# Altium project Ornithopter Camera.PrjPcb
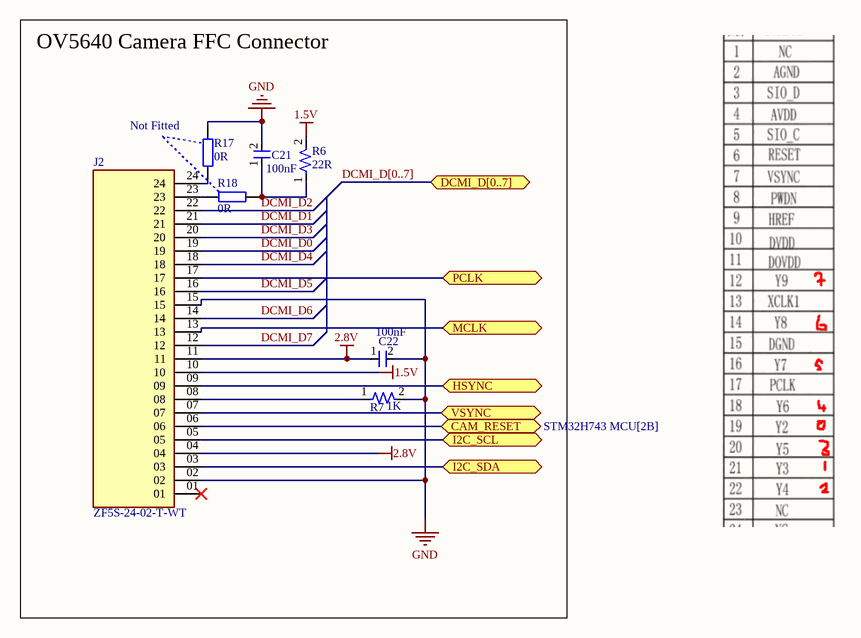
[diagram p0: OV5640 Camera.SchDoc]
5 sheets, 101 parts. Net scope: flat (ports and power ports of the same name join across sheets).
Board file: Camera.PcbDoc
Sheets:
  OV5640 Camera.SchDoc
  External SDRAM.SchDoc
  Microphone-Other Parts.SchDoc
  STM32H743 MCU.SchDoc
  Power Input.SchDoc

## Sheet OV5640 Camera.SchDoc: Ornihopter Kamera Kartı
size A4; CompanyName: Erü EMM; Engineer: Berat Bayram; Address1: https://www.linkedin.com/in/beratbayram-eee/; DocumentNumber: OKK_1; Revision: V1; SheetNumber: 1; SheetTotal: 5

### Parts
C21  C: 100nF  [0603 Cap]  (hidden comment: 0603)
C22  C: 100nF  [0603 Cap]  (hidden comment: 0603)
J2  ZF5S-24-02-T-WT  [SAMTEC_ZF5S-24-02-T-WT]
R6  R: 22R  [0603 Res]  (hidden comment: 0603)
R7  R: 1K  [0603 Res]  (hidden comment: 0603)
R17  0R  [RES_0402]
R18  0R  [RES_0402]

### Ports
CAM_RESET (bidir, see STM32H743 MCU[2B]), DCMI_D[0..7] (bidir, see STM32H743 MCU[8B]), HSYNC (bidir, see STM32H743 MCU[2C]), I2C_SCL (bidir, see STM32H743 MCU[6C]), I2C_SDA (bidir, see STM32H743 MCU[6C]), MCLK (bidir, see STM32H743 MCU[2C]), PCLK (bidir, see STM32H743 MCU[2C]), VSYNC (bidir, see STM32H743 MCU[6C])

### Nets
1.5V: J2.10 R6.2
2.8V: C22.1 J2.04 J2.11
GND: C21.2 C22.2 J2.02 J2.15 R7.2 R17.2
DCMI_D0: J2.19
DCMI_D1: J2.21
DCMI_D2: J2.22
DCMI_D3: J2.20
DCMI_D4: J2.18
DCMI_D5: J2.16
DCMI_D6: J2.14
DCMI_D7: J2.12
NetC21_1: C21.1 R6.1 R18.1
NetJ2_03: J2.03 ; port I2C_SDA
NetJ2_05: J2.05 ; port I2C_SCL
NetJ2_06: J2.06 ; port CAM_RESET
NetJ2_07: J2.07 ; port VSYNC
NetJ2_08: J2.08 R7.1
NetJ2_09: J2.09 ; port HSYNC
NetJ2_13: J2.13 ; port MCLK
NetJ2_17: J2.17 ; port PCLK
NetJ2_23: J2.23 R18.2
NetJ2_24: J2.24 R17.1

Not connected (* = marked no-connect by the designer): J2 01*

### Buses and harness runs
bus DCMI_D[0..7] = port DCMI_D[0..7]

### Notes on the sheet
- OV5640 Camera FFC Connector
- (near R17) Not Fitted
- Title:
- Enigneer:
- Page Contents:
- Company:
- Size:
- Date:
- File:
- Website:
- A4
- Number:
- Time:
- Revision:
- Sheet

### Library data of the parts
C21 C22 = 0603 Cap
R6 R7 = 0603 Res
R17 R18 = RES_0402: Resistor SMD 0402; Manufacturer: *; Manufacturer Part Number: *; Distributor Link: *; LCSC: *
J2 = ZF5S-24-02-T-WT: MP: ZF5S-24-02-T-WT; Value: *; Price: None; Availability: Unavailable; Package: None

## Sheet External SDRAM.SchDoc: Ornihopter Kamera Kartı
size A4; CompanyName: Erü EEM; Engineer: Berat Bayram; Address1: https://www.linkedin.com/in/beratbayram-eee/; DocumentNumber: OKK_1; Revision: V1; SheetNumber: 2; SheetTotal: 5
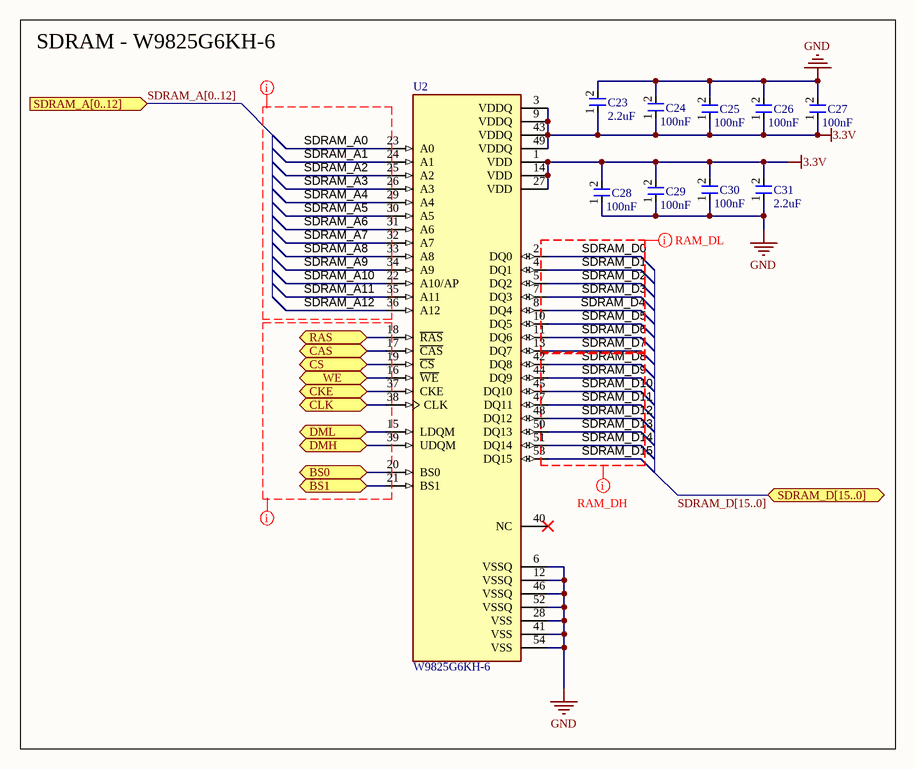
[diagram p1: External SDRAM.SchDoc]

### Parts
C23  C: 2.2uF  [0603 Cap]  (hidden comment: 0603)
C24  C: 100nF  [0603 Cap]  (hidden comment: 0603)
C25  C: 100nF  [0603 Cap]  (hidden comment: 0603)
C26  C: 100nF  [0603 Cap]  (hidden comment: 0603)
C27  C: 100nF  [0603 Cap]  (hidden comment: 0603)
C28  C: 100nF  [0603 Cap]  (hidden comment: 0603)
C29  C: 100nF  [0603 Cap]  (hidden comment: 0603)
C30  C: 100nF  [0603 Cap]  (hidden comment: 0603)
C31  C: 2.2uF  [0603 Cap]  (hidden comment: 0603)
U2  W9825G6KH-6  [SOP80P1176X120-54N]

### Blocks framed on the sheet
SDRAM - W9825G6KH-6: C23-C31 U2

### Ports
BS0 (bidir, see STM32H743 MCU[6B]), BS1 (bidir, see STM32H743 MCU[6B]), CAS (bidir, see STM32H743 MCU[6C]), CKE (bidir, see STM32H743 MCU[4C]), CLK (bidir, see STM32H743 MCU[6C]), CS (bidir, see STM32H743 MCU[4C]), DMH (bidir, see STM32H743 MCU[4B]), DML (bidir, see STM32H743 MCU[4B]), RAS (bidir, see STM32H743 MCU[2C]), SDRAM_A[0..12] (in, see STM32H743 MCU[5A]), SDRAM_D[15..0] (bidir, see STM32H743 MCU[7B]), WE (bidir, see STM32H743 MCU[2C])

### Nets
3.3V: C23.1 C24.1 C25.1 C26.1 C27.1 C28.2 C29.2 C30.2 C31.2 U2.1(VDD) U2.3(VDDQ) U2.9(VDDQ) U2.14(VDD) U2.27(VDD) U2.43(VDDQ) U2.49(VDDQ)
GND: C23.2 C24.2 C25.2 C26.2 C27.2 C28.1 C29.1 C30.1 C31.1 U2.6(VSSQ) U2.12(VSSQ) U2.28(VSS) U2.41(VSS) U2.46(VSSQ) U2.52(VSSQ) U2.54(VSS)
SDRAM_A0: U2.23(A0)
SDRAM_A1: U2.24(A1)
SDRAM_A2: U2.25(A2)
SDRAM_A3: U2.26(A3)
SDRAM_A4: U2.29(A4)
SDRAM_A5: U2.30(A5)
SDRAM_A6: U2.31(A6)
SDRAM_A7: U2.32(A7)
SDRAM_A8: U2.33(A8)
SDRAM_A9: U2.34(A9)
SDRAM_A10: U2.22(A10/AP)
SDRAM_A11: U2.35(A11)
SDRAM_A12: U2.36(A12)
SDRAM_D0: U2.2(DQ0)
SDRAM_D1: U2.4(DQ1)
SDRAM_D2: U2.5(DQ2)
SDRAM_D3: U2.7(DQ3)
SDRAM_D4: U2.8(DQ4)
SDRAM_D5: U2.10(DQ5)
SDRAM_D6: U2.11(DQ6)
SDRAM_D7: U2.13(DQ7)
SDRAM_D8: U2.42(DQ8)
SDRAM_D9: U2.44(DQ9)
SDRAM_D10: U2.45(DQ10)
SDRAM_D11: U2.47(DQ11)
SDRAM_D12: U2.48(DQ12)
SDRAM_D13: U2.50(DQ13)
SDRAM_D14: U2.51(DQ14)
SDRAM_D15: U2.53(DQ15)
NetU1_43: U2.16(~{WE}) ; port WE
NetU1_44: U2.19(~{CS}) ; port CS
NetU1_45: U2.37(CKE) ; port CKE
NetU1_49: U2.18(~{RAS}) ; port RAS
NetU1_89: U2.20(BS0) ; port BS0
NetU1_90: U2.21(BS1) ; port BS1
NetU1_93: U2.38(CLK) ; port CLK
NetU1_132: U2.17(~{CAS}) ; port CAS
NetU1_141: U2.15(LDQM) ; port DML
NetU1_142: U2.39(UDQM) ; port DMH

Not connected (* = marked no-connect by the designer): U2 40(NC)*

### Buses and harness runs
bus SDRAM_A[0..12] = port SDRAM_A[0..12]
bus SDRAM_D[15..0] = port SDRAM_D[15..0]

### Layout directives
net class RAM_DH: SDRAM_D8, SDRAM_D9, SDRAM_D10, SDRAM_D11, SDRAM_D12, SDRAM_D13, SDRAM_D14, SDRAM_D15
net class RAM_DL: SDRAM_D0, SDRAM_D1, SDRAM_D2, SDRAM_D3, SDRAM_D4, SDRAM_D5, SDRAM_D6, SDRAM_D7
net class SD_Add: SDRAM_A0, SDRAM_A1, SDRAM_A2, SDRAM_A3, SDRAM_A4, SDRAM_A5, SDRAM_A6, SDRAM_A7, SDRAM_A8, SDRAM_A9, SDRAM_A10, SDRAM_A11, SDRAM_A12
net class SD_Pins: (no net found under the mark)

### Notes on the sheet
- Title:
- Enigneer:
- Page Contents:
- Company:
- Size:
- Date:
- File:
- Website:
- A4
- Number:
- Time:
- Revision:
- Sheet

### Library data of the parts
C23-C31 = 0603 Cap
U2 = W9825G6KH-6: SDRAM Memory IC 256Mb (16M x 16) Parallel 166MHz 5ns 54-TSOP II; MF: {'manufacturer': u'Winbond Electronics'}; Package: None; MP: W9825G6KH-6; Availability: Unavailable; Price: None

## Sheet Microphone-Other Parts.SchDoc: Ornihopter Kamera Kartı
size A3; CompanyName: Erü EEM; Engineer: Berat Bayram; Address1: https://www.linkedin.com/in/beratbayram-eee/; DocumentNumber: OKK_1; Revision: V1; SheetNumber: 3; SheetTotal: 5
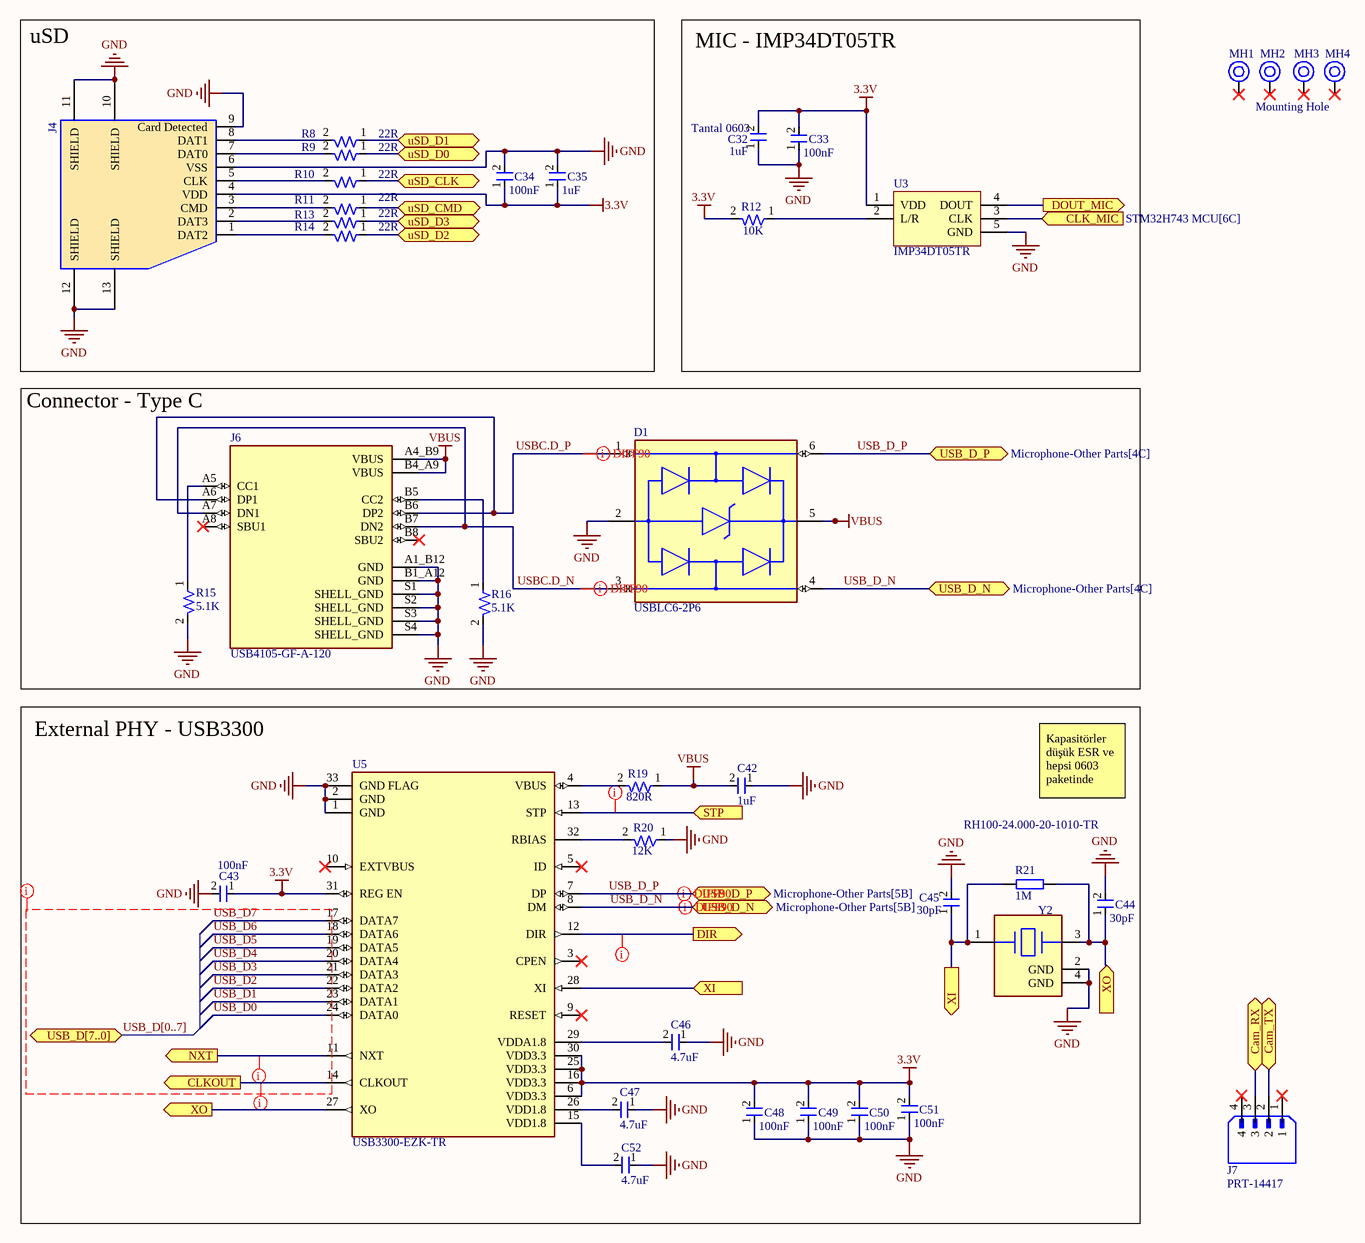
[diagram p2: Microphone-Other Parts.SchDoc]

### Parts
C32  Tantal 0603  C: 1uF  [0603 Cap]
C33  C: 100nF  [0603 Cap]  (hidden comment: 0603)
C34  C: 100nF  [0603 Cap]  (hidden comment: 0603)
C35  C: 1uF  [0603 Cap]  (hidden comment: 0603)
C42  C: 1uF  [0603 Cap]  (hidden comment: 0603)
C43  C: 100nF  [0603 Cap]  (hidden comment: 0603)
C44  C: 30pF  [0603 Cap]  (hidden comment: 0603)
C45  C: 30pF  [0603 Cap]  (hidden comment: 0603)
C46  C: 4.7uF  [0603 Cap]  (hidden comment: 0603)
C47  C: 4.7uF  [0603 Cap]  (hidden comment: 0603)
C48  C: 100nF  [0603 Cap]  (hidden comment: 0603)
C49  C: 100nF  [0603 Cap]  (hidden comment: 0603)
C50  C: 100nF  [0603 Cap]  (hidden comment: 0603)
C51  C: 100nF  [0603 Cap]  (hidden comment: 0603)
C52  C: 4.7uF  [0603 Cap]  (hidden comment: 0603)
D1  USBLC6-2P6  [FP-SOT-666-MFG]
J4  KLS1-TF-003-R  [KLS1-TF-003-R]  (value not drawn)
J6  USB4105-GF-A-120  [GCT_USB4105-GF-A-120]
J7  PRT-14417  [SPARKFUN_PRT-14417]
MH1  Mounting Hole  [MOUNTING]
MH2  Mounting Hole  [MOUNTING]  (value not drawn)
MH3  Mounting Hole  [MOUNTING]  (value not drawn)
MH4  Mounting Hole  [MOUNTING]  (value not drawn)
R8  R: 22R  [0603 Res]  (hidden comment: 0603)
R9  R: 22R  [0603 Res]  (hidden comment: 0603)
R10  R: 22R  [0603 Res]  (hidden comment: 0603)
R11  R: 22R  [0603 Res]  (hidden comment: 0603)
R12  R: 10K  [0603 Res]  (hidden comment: 0603)
R13  R: 22R  [0603 Res]  (hidden comment: 0603)
R14  R: 22R  [0603 Res]  (hidden comment: 0603)
R15  R: 5.1K  [0603 Res]  (hidden comment: 0603)
R16  R: 5.1K  [0603 Res]  (hidden comment: 0603)
R19  R: 820R  [0603 Res]  (hidden comment: 0603)
R20  R: 12K  [0603 Res]  (hidden comment: 0603)
R21  1M  [RES_0603]
U3  IMP34DT05TR  [HCLGA-4_53_137_15X37_SMD]
U5  USB3300-EZK-TR  [FP-32QFN-3304-5X5B-MFG]
Y2  RH100-24.000-20-1010-TR  [FP-ABM8AIG-MFG]

### Blocks framed on the sheet
uSD: C34 C35 J4 R8-R11 R13 R14
MIC - IMP34DT05TR: C32 C33 R12 U3
Connector - Type C: D1 J6 R15 R16
External PHY - USB3300: C42-C52 R19-R21 U5 Y2

### Ports
Cam_RX (bidir, see STM32H743 MCU[2C]), Cam_TX (bidir, see STM32H743 MCU[2C]), CLK_MIC (in, see STM32H743 MCU[6C]), CLKOUT (out, see STM32H743 MCU[2C]), DIR (out, see STM32H743 MCU[4C]), DOUT_MIC (out, see STM32H743 MCU[6C]), NXT (out, see STM32H743 MCU[4C]), STP (in, see STM32H743 MCU[4C]), USB_D[7..0] (bidir, see STM32H743 MCU[7C]), USB_D_N (bidir, see Microphone-Other Parts[4C]), USB_D_N (bidir, see Microphone-Other Parts[5B]), USB_D_P (bidir, see Microphone-Other Parts[4C]), USB_D_P (bidir, see Microphone-Other Parts[5B]), uSD_CLK (bidir, see STM32H743 MCU[4C]), uSD_CMD (bidir, see STM32H743 MCU[4B]), uSD_D0 (bidir, see STM32H743 MCU[4C]), uSD_D1 (bidir, see STM32H743 MCU[4C]), uSD_D2 (bidir, see STM32H743 MCU[4C]), uSD_D3 (bidir, see STM32H743 MCU[4C]), XI (in, see Microphone-Other Parts[5C]), XI (out, see Microphone-Other Parts[4C]), XO (in, see Microphone-Other Parts[2D]), XO (out, see Microphone-Other Parts[6C])

### Nets
3.3V: C32.2 C33.2 C34.1 C35.1 C43.1 C48.2 C49.2 C50.2 C51.2 J4.4(VDD) R12.2 U3.1(VDD) U5.6(VDD3.3) U5.16(VDD3.3) U5.25(VDD3.3) U5.30(VDD3.3) U5.31(REG_EN)
GND: C32.1 C33.1 C34.2 C35.2 C42.1 C43.2 C44.2 C45.2 C46.1 C47.1 C48.1 C49.1 C50.1 C51.1 C52.1 D1.2(GND) J4.6(VSS) J4.9(Card_Detected) J4.10(SHIELD) J4.11(SHIELD) J4.12(SHIELD) J4.13(SHIELD) J6.A1_B12(GND) J6.B1_A12(GND) J6.S1(SHELL_GND) J6.S2(SHELL_GND) J6.S3(SHELL_GND) J6.S4(SHELL_GND) R15.2 R16.2 R20.1 U3.5(GND) U5.1(GND) U5.2(GND) U5.33(GND_FLAG) Y2.2(GND) Y2.4(GND)
VBUS: C42.2 D1.5(VBUS) J6.A4_B9(VBUS) J6.B4_A9(VBUS) R19.1
USB_D0: U5.24(DATA0)
USB_D1: U5.23(DATA1)
USB_D2: U5.22(DATA2)
USB_D3: U5.21(DATA3)
USB_D4: U5.20(DATA4)
USB_D5: U5.19(DATA5)
USB_D6: U5.18(DATA6)
USB_D7: U5.17(DATA7)
USB_D_N: D1.4(I/O2) U5.8(DM) ; port USB_D_N
USB_D_P: D1.6(I/O1) U5.7(DP) ; port USB_D_P
USBC.D_N: D1.3(I/O2) J6.A7(DN1) J6.B7(DN2)
USBC.D_P: D1.1(I/O1) J6.A6(DP1) J6.B6(DP2)
NetC44_1: C44.1 R21.2 U5.27(XO) Y2.3 ; port XO
NetC45_1: C45.1 R21.1 U5.28(XI) Y2.1 ; port XI
NetC46_2: C46.2 U5.29(VDDA1.8)
NetC47_2: C47.2 U5.26(VDD1.8)
NetC52_2: C52.2 U5.15(VDD1.8)
NetJ4_1: J4.1(DAT2) R14.2
NetJ4_2: J4.2(DAT3) R13.2
NetJ4_3: J4.3(CMD) R11.2
NetJ4_5: J4.5(CLK) R10.2
NetJ4_7: J4.7(DAT0) R9.2
NetJ4_8: J4.8(DAT1) R8.2
NetJ6_A5: J6.A5(CC1) R15.1
NetJ6_B5: J6.B5(CC2) R16.1
NetJ7_2: J7.2 ; port Cam_TX
NetJ7_3: J7.3 ; port Cam_RX
NetR8_1: R8.1 ; port uSD_D1
NetR9_1: R9.1 ; port uSD_D0
NetR10_1: R10.1 ; port uSD_CLK
NetR11_1: R11.1 ; port uSD_CMD
NetR12_1: R12.1 U3.2(L/R)
NetR13_1: R13.1 ; port uSD_D3
NetR14_1: R14.1 ; port uSD_D2
NetR19_2: R19.2 U5.4(VBUS)
NetR20_2: R20.2 U5.32(RBIAS)
NetU1_26: U5.13(STP) ; port STP
NetU1_28: U5.12(DIR) ; port DIR
NetU1_29: U5.11(NXT) ; port NXT
NetU1_41: U5.14(CLKOUT) ; port CLKOUT
NetU1_133: U3.3(CLK) ; port CLK_MIC
NetU1_134: U3.4(DOUT) ; port DOUT_MIC

Not connected (* = marked no-connect by the designer): J6 A8(SBU1)* B8(SBU2)*; J7 1* 4*; MH1 1*; MH2 1*; MH3 1*; MH4 1*; U5 3(CPEN)* 5(ID)* 9(RESET)* 10(EXTVBUS)*

### Buses and harness runs
bus USB_D[0..7] = port USB_D[7..0]

### Layout directives
differential pair; differential pair class DIFF90: USB_D_N, USB_D_P, USBC.D_N, USBC.D_P
net class USB3300: NetU1_26, NetU1_28, NetU1_29, NetU1_41, USB_D0, USB_D1, USB_D2, USB_D3, USB_D4, USB_D5, USB_D6, USB_D7, USB_D[0..7]

### Notes on the sheet
- Kapasitörler düşük ESR ve hepsi 0603 paketinde
- Title:
- Enigneer:
- Page Contents:
- Company:
- Size:
- Date:
- File:
- Website:
- A3
- Number:
- Time:
- Revision:
- Sheet

### Library data of the parts
C32-C35 C42-C52 = 0603 Cap
D1 = CMP-12225-000058-1: TVS DIODE 5.25V 17V SOT666; Min Breakdown Voltage: 6V; Power Line Protection: Yes; Element Configuration: Dual; Test Current: 1mA; Working Voltage: 5V; Number of Channels: 2; Max Reverse Leakage Current: 150nA; Direction: Unidirectional; Peak Pulse Current: 5A; Number of Elements: 1; Capacitance: 3.5pF; Max Breakdown Voltage: 6V; Height: 0.6mm; Depth: 1.3mm; Contact Plating: Tin; Reverse Breakdown Voltage: 6V; REACH SVHC: No SVHC; Operating Supply Voltage: 5V; Width: 1.3mm; Max Operating Temperature: 125°C; Reverse Standoff Voltage: 5V; ESD Protection: Yes; Package Quantity: 1; Termination: SMD/SMT; Length: 1.7mm; Leakage Current: 150nA; Number of Bidirectional Channels: 2; Case/Package: SOT-666; Min Operating Temperature: -40°C; Number of Pins: 6; Clamping Voltage: 17V; Breakdown Voltage: 6V; Lead Free: Lead Free; Radiation Hardening: No; Packaging: Tape and Reel; Mount: Surface Mount; Polarity: Unidirectional
J4 = KLS1-TF-003-R: KLS1-TF-003-R                     SD CARD CONNECTOR
J6 = USB4105-GF-A-120: USB CONN, 2.0 TYPE C, RCPT, 16POS, SMT; USB Connector Type:USB Type C; USB Standard:USB 2.0; Gender:Receptacle; No. of Positions:16Positions; Connector Mounting:Surface Mount, Through Hole Mount; Orientation:Right Angle RoHS Compliant: Yes; MF: Global Connector Technology; MP: USB4105GFA120; Package: None; Price: None; Value: *; SnapEDA_Link: https://www.snapeda.com/parts/USB4105GFA120/Global+Connector+Technology/view-part/?ref=snap; Availability: In Stock; Check_prices: https://www.snapeda.com/parts/USB4105GFA120/Global+Connector+Technology/view-part/?ref=eda
J7 = PRT-14417: QWIIC JST CONNECTOR - SMD 4-PIN; MF: SparkFun Electronics; SnapEDA_Link: https://www.snapeda.com/parts/PRT-14417/SparkFun+Electronics/view-part/?ref=snap; Package: None; Value: *; MP: PRT-14417; Check_prices: https://www.snapeda.com/parts/PRT-14417/SparkFun+Electronics/view-part/?ref=eda
MH1-MH4 = MH_3.5H_6D: Manufacturer Part Number: NA; Case/Package: TH; Manufacturer: NA; Supplier-1: NA; Supplier Part Number-1: NA; Alternate Part Number-1: NA
R8-R16 R19 R20 = 0603 Res
R21 = RES_0603: Resistor SMD 0603; Manufacturer: *; Manufacturer Part Number: *; Distributor Link: *; LCSC: *
U3 = IC_IMP34DT05TR: MEMS Microphones AUTO & INDUSTRIAL SENSORS; Manufacturer: STMicroelectronics; Alternate Part Number-1: NA; Manufacturer Part Number: IMP34DT05TR; Case/Package: HCLGA-4; Supplier-1: Mouser; Supplier Part Number-1: 511-IMP34DT05TR
U5 = CMP-0186-00339-2: IC CONTROLLER USB 32QFN; Manufacturer: Microchip; Min Supply Voltage: 3V; Standoff Height: 0mm; Interface: USB,Other; Number Of Ports: 1; Usb Standard: USB 2.0; Nominal Supply Current: 25.5-39600uA; Max Supply Voltage: 3.6V; Temperature Range High: +85°C; Mouser Description: USB Interface IC USB 2.0 PHY ULPI; Device Class L3: USB Interface ICs; Package: 32QFN-3304-5X5B; ComponentLink2URL: http://ww1.microchip.com/downloads/en/DeviceDoc/00001783C.pdf; Ambient Temperature Range Low: -40°C; Temperature Range Low: -40°C; Temperature: -40°C to +85°C; ComponentLink2Description: Datasheet; RoHS: TRUE; Digikey Description: IC CONTROLLER USB 32QFN; Device Class L1: Integrated Circuits (ICs); Manufacturer Part Number: USB3300-EZK-TR; Automotive: No; Height: 1mm; Ipc Land Pattern Name: QFN50P500X500X85-32; Lead Free: Yes; Ambient Temperature Range High: +85°C; Category: IC; Device Class L2: Interface ICs; Octopart: https://octopart.com/usb3300-ezk-tr-microchip-24995444
Y2 = CMP-27762-015716-1: Crystal 24MHz ±20ppm (Tol) ±50ppm (Stability) 12pF FUND 50Ω Automotive 4-Pin Ultra Mini-CSMD T/R; ESR (Equivalent Series Resistance): 50R; Series: ABM8AIG; RoHS Compliant: Yes; Load Capacitance: 12pF; Height: 0.031inch; Min Operating Temperature: -40°C; Mount: Surface Mount; Packaging: Cut Tape; Ratings: AEC-Q200; Case/Package: SMD/SMT; Frequency Stability: 50ppm; Max Operating Temperature: 125°C; Length: 0.126inch; Frequency: 24MHz; Frequency Tolerance: 20ppm; Width: 0.098inch

## Sheet STM32H743 MCU.SchDoc: Ornihopter Kamera Kartı
size A3; CompanyName: Erü EEM; Engineer: Berat Bayram; Address1: https://www.linkedin.com/in/beratbayram-eee/; DocumentNumber: OKK_1; Revision: V1; SheetNumber: 4; SheetTotal: 5
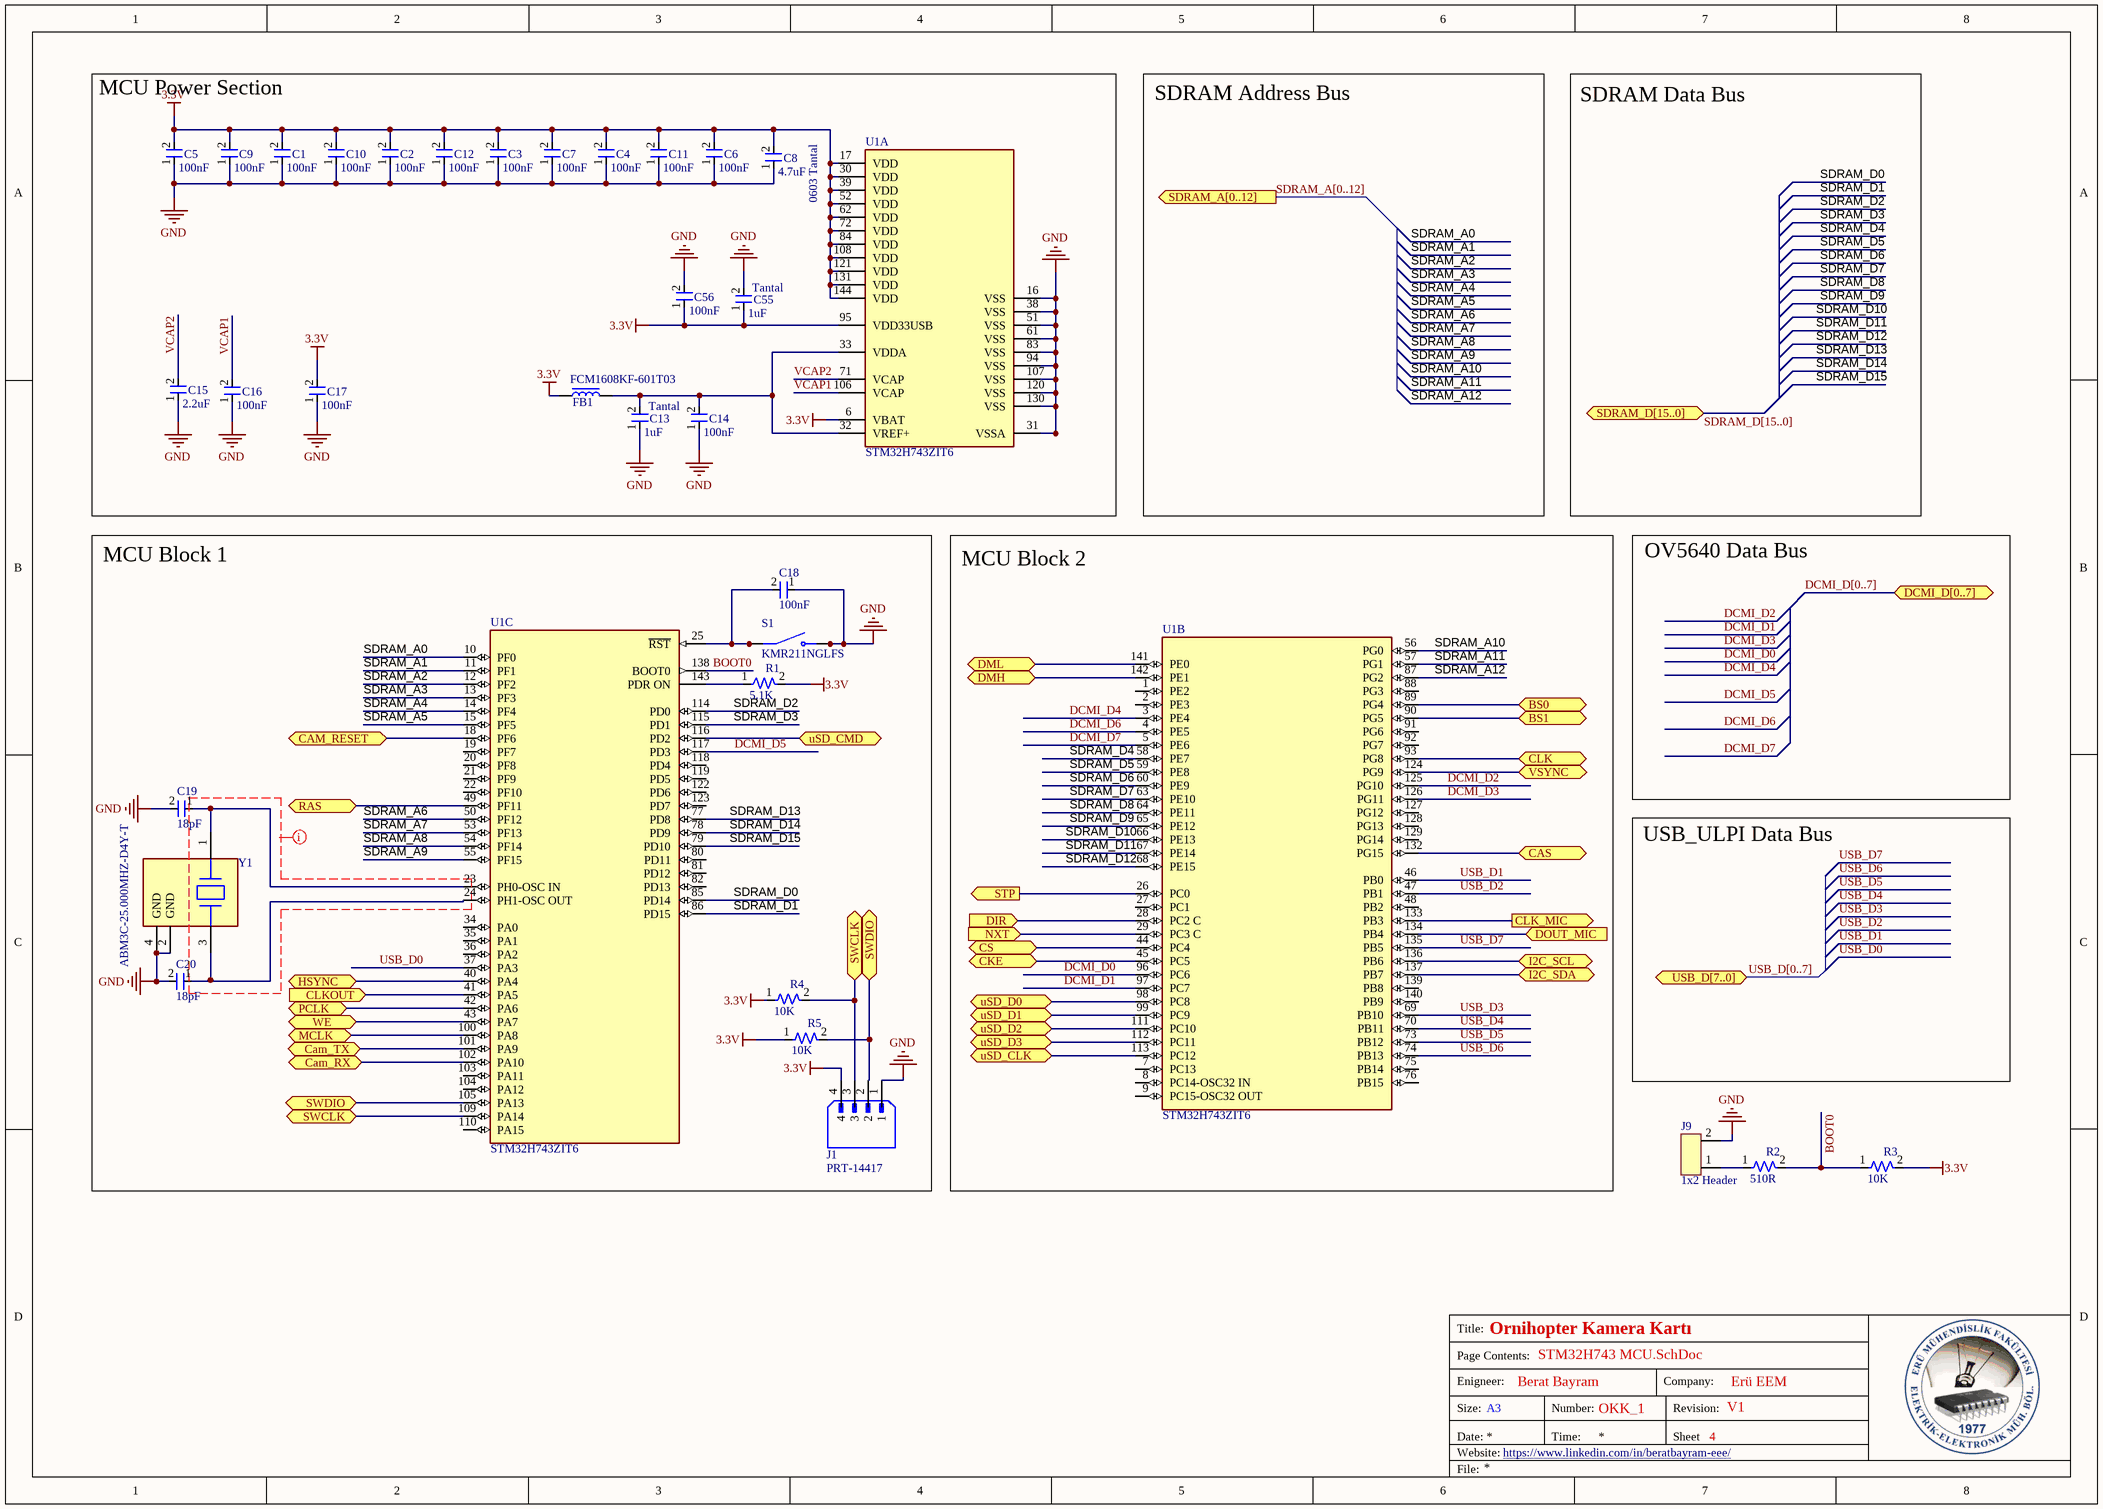
[diagram p3: STM32H743 MCU.SchDoc]

### Parts
C1  C: 100nF  [0603 Cap]  (hidden comment: 0603)
C2  C: 100nF  [0603 Cap]  (hidden comment: 0603)
C3  C: 100nF  [0603 Cap]  (hidden comment: 0603)
C4  C: 100nF  [0603 Cap]  (hidden comment: 0603)
C5  C: 100nF  [0603 Cap]  (hidden comment: 0603)
C6  C: 100nF  [0603 Cap]  (hidden comment: 0603)
C7  C: 100nF  [0603 Cap]  (hidden comment: 0603)
C8  0603 Tantal  C: 4.7uF  [0603 Cap]
C9  C: 100nF  [0603 Cap]  (hidden comment: 0603)
C10  C: 100nF  [0603 Cap]  (hidden comment: 0603)
C11  C: 100nF  [0603 Cap]  (hidden comment: 0603)
C12  C: 100nF  [0603 Cap]  (hidden comment: 0603)
C13  Tantal  C: 1uF  [0603 Cap]
C14  C: 100nF  [0603 Cap]  (hidden comment: 0603)
C15  C: 2.2uF  [0603 Cap]  (hidden comment: 0603)
C16  C: 100nF  [0603 Cap]  (hidden comment: 0603)
C17  C: 100nF  [0603 Cap]  (hidden comment: 0603)
C18  C: 100nF  [0603 Cap]  (hidden comment: 0603)
C19  C: 18pF  [0603 Cap]  (hidden comment: 0603)
C20  C: 18pF  [0603 Cap]  (hidden comment: 0603)
C55  Tantal  C: 1uF  [0603 Cap]
C56  C: 100nF  [0603 Cap]  (hidden comment: 0603)
FB1  FCM1608KF-601T03  [FB_0603]
J1  PRT-14417  [SPARKFUN_PRT-14417]
J9  1x2 Header  [1x2 Header]
R1  R: 5.1K  [0603 Res]  (hidden comment: 0603)
R2  R: 510R  [0603 Res]  (hidden comment: 0603)
R3  R: 10K  [0603 Res]  (hidden comment: 0603)
R4  R: 10K  [0603 Res]  (hidden comment: 0603)
R5  R: 10K  [0603 Res]  (hidden comment: 0603)
S1  KMR211NGLFS  [SW_KMR211NGLFS]
U1  STM32H743ZIT6  [FP-LQFP144-1A-MFG]  (parts A,B,C of 3)
Y1  ABM3C-25.000MHZ-D4Y-T  [FP-ABM3C-MFG]

### Blocks framed on the sheet
MCU Power Section: C1-C17 C55 C56 FB1 U1
MCU Block 1: C18-C20 J1 R1 R4 R5 S1 U1 Y1
MCU Block 2: U1

### Ports
BS0 (bidir, see External SDRAM[2C]), BS1 (bidir, see External SDRAM[2C]), CAM_RESET (bidir, see OV5640 Camera[3C]), Cam_RX (bidir, see Microphone-Other Parts[6D]), Cam_TX (bidir, see Microphone-Other Parts[6D]), CAS (bidir, see External SDRAM[2B]), CKE (bidir, see External SDRAM[2B]), CLK (bidir, see External SDRAM[2B]), CLK_MIC (out, see Microphone-Other Parts[5A]), CLKOUT (in, see Microphone-Other Parts[2D]), CS (bidir, see External SDRAM[2B]), DCMI_D[0..7] (bidir, see OV5640 Camera[3B]), DIR (in, see Microphone-Other Parts[4C]), DMH (bidir, see External SDRAM[2B]), DML (bidir, see External SDRAM[2B]), DOUT_MIC (in, see Microphone-Other Parts[5A]), HSYNC (bidir, see OV5640 Camera[3B]), I2C_SCL (bidir, see OV5640 Camera[3C]), I2C_SDA (bidir, see OV5640 Camera[3C]), MCLK (bidir, see OV5640 Camera[3B]), NXT (in, see Microphone-Other Parts[2D]), PCLK (bidir, see OV5640 Camera[3B]), RAS (bidir, see External SDRAM[2B]), SDRAM_A[0..12] (out, see External SDRAM[1A]), SDRAM_D[15..0] (bidir, see External SDRAM[3C]), STP (out, see Microphone-Other Parts[4C]), SWCLK (bidir, see STM32H743 MCU[2C]), SWCLK (bidir, see STM32H743 MCU[4C]), SWDIO (bidir, see STM32H743 MCU[2C]), SWDIO (bidir, see STM32H743 MCU[4C]), USB_D[7..0] (bidir, see Microphone-Other Parts[1C]), uSD_CLK (bidir, see Microphone-Other Parts[3A]), uSD_CMD (bidir, see Microphone-Other Parts[3A]), uSD_D0 (bidir, see Microphone-Other Parts[3A]), uSD_D1 (bidir, see Microphone-Other Parts[3A]), uSD_D2 (bidir, see Microphone-Other Parts[3A]), uSD_D3 (bidir, see Microphone-Other Parts[3A]), VSYNC (bidir, see OV5640 Camera[3C]), WE (bidir, see External SDRAM[2B])

### Nets
3.3V: C1.2 C2.2 C3.2 C4.2 C5.2 C6.2 C7.2 C8.2 C9.2 C10.2 C11.2 C12.2 C17.2 C55.1 C56.1 FB1.1 J1.4 R1.2 R3.2 R4.1 R5.1 U1.6(VBAT) U1.17(VDD) U1.30(VDD) U1.39(VDD) U1.52(VDD) U1.62(VDD) U1.72(VDD) U1.84(VDD) U1.95(VDD33USB) U1.108(VDD) U1.121(VDD) U1.131(VDD) U1.144(VDD)
GND: C1.1 C2.1 C3.1 C4.1 C5.1 C6.1 C7.1 C8.1 C9.1 C10.1 C11.1 C12.1 C13.1 C14.1 C15.1 C16.1 C17.1 C18.1 C19.2 C20.2 C55.2 C56.2 J1.1 J9.2 S1.3(NO) S1.4(NO) U1.16(VSS) U1.31(VSSA) U1.38(VSS) U1.51(VSS) U1.61(VSS) U1.83(VSS) U1.94(VSS) U1.107(VSS) U1.120(VSS) U1.130(VSS) Y1.2(GND) Y1.4(GND)
BOOT0: R2.2 R3.1 U1.138(BOOT0)
DCMI_D0: U1.96(PC6)
DCMI_D1: U1.97(PC7)
DCMI_D2: U1.125(PG10)
DCMI_D3: U1.126(PG11)
DCMI_D4: U1.3(PE4)
DCMI_D5: U1.117(PD3)
DCMI_D6: U1.4(PE5)
DCMI_D7: U1.5(PE6)
SDRAM_A0: U1.10(PF0)
SDRAM_A1: U1.11(PF1)
SDRAM_A2: U1.12(PF2)
SDRAM_A3: U1.13(PF3)
SDRAM_A4: U1.14(PF4)
SDRAM_A5: U1.15(PF5)
SDRAM_A6: U1.50(PF12)
SDRAM_A7: U1.53(PF13)
SDRAM_A8: U1.54(PF14)
SDRAM_A9: U1.55(PF15)
SDRAM_A10: U1.56(PG0)
SDRAM_A11: U1.57(PG1)
SDRAM_A12: U1.87(PG2)
SDRAM_D0: U1.85(PD14)
SDRAM_D1: U1.86(PD15)
SDRAM_D2: U1.114(PD0)
SDRAM_D3: U1.115(PD1)
SDRAM_D4: U1.58(PE7)
SDRAM_D5: U1.59(PE8)
SDRAM_D6: U1.60(PE9)
SDRAM_D7: U1.63(PE10)
SDRAM_D8: U1.64(PE11)
SDRAM_D9: U1.65(PE12)
SDRAM_D10: U1.66(PE13)
SDRAM_D11: U1.67(PE14)
SDRAM_D12: U1.68(PE15)
SDRAM_D13: U1.77(PD8)
SDRAM_D14: U1.78(PD9)
SDRAM_D15: U1.79(PD10)
USB_D0: U1.37(PA3)
USB_D1: U1.46(PB0)
USB_D2: U1.47(PB1)
USB_D3: U1.69(PB10)
USB_D4: U1.70(PB11)
USB_D5: U1.73(PB12)
USB_D6: U1.74(PB13)
USB_D7: U1.135(PB5)
VCAP1: C16.2 U1.106(VCAP)
VCAP2: C15.2 U1.71(VCAP)
NetC13_2: C13.2 C14.2 FB1.2 U1.32(VREF+) U1.33(VDDA)
NetC18_2: C18.2 S1.1(COM) S1.2(COM) U1.25(~{RST})
NetC19_1: C19.1 U1.23(PH0-OSC_IN) Y1.1
NetC20_1: C20.1 U1.24(PH1-OSC_OUT) Y1.3
NetJ1_2: J1.2 R5.2 U1.105(PA13) ; port SWDIO
NetJ1_3: J1.3 R4.2 U1.109(PA14) ; port SWCLK
NetJ2_03: U1.137(PB7) ; port I2C_SDA
NetJ2_05: U1.136(PB6) ; port I2C_SCL
NetJ2_06: U1.18(PF6) ; port CAM_RESET
NetJ2_07: U1.124(PG9) ; port VSYNC
NetJ2_09: U1.40(PA4) ; port HSYNC
NetJ2_13: U1.100(PA8) ; port MCLK
NetJ2_17: U1.42(PA6) ; port PCLK
NetJ7_2: U1.101(PA9) ; port Cam_TX
NetJ7_3: U1.102(PA10) ; port Cam_RX
NetJ9_1: J9.1 R2.1
NetR1_1: R1.1 U1.143(PDR_ON)
NetR8_1: U1.99(PC9) ; port uSD_D1
NetR9_1: U1.98(PC8) ; port uSD_D0
NetR10_1: U1.113(PC12) ; port uSD_CLK
NetR11_1: U1.116(PD2) ; port uSD_CMD
NetR13_1: U1.112(PC11) ; port uSD_D3
NetR14_1: U1.111(PC10) ; port uSD_D2
NetU1_26: U1.26(PC0) ; port STP
NetU1_28: U1.28(PC2_C) ; port DIR
NetU1_29: U1.29(PC3_C) ; port NXT
NetU1_41: U1.41(PA5) ; port CLKOUT
NetU1_43: U1.43(PA7) ; port WE
NetU1_44: U1.44(PC4) ; port CS
NetU1_45: U1.45(PC5) ; port CKE
NetU1_49: U1.49(PF11) ; port RAS
NetU1_89: U1.89(PG4) ; port BS0
NetU1_90: U1.90(PG5) ; port BS1
NetU1_93: U1.93(PG8) ; port CLK
NetU1_132: U1.132(PG15) ; port CAS
NetU1_133: U1.133(PB3) ; port CLK_MIC
NetU1_134: U1.134(PB4) ; port DOUT_MIC
NetU1_141: U1.141(PE0) ; port DML
NetU1_142: U1.142(PE1) ; port DMH

Not connected (* = marked no-connect by the designer): U1 1(PE2) 2(PE3) 7(PC13) 8(PC14-OSC32_IN) 9(PC15-OSC32_OUT) 19(PF7) 20(PF8) 21(PF9) 22(PF10) 27(PC1) 34(PA0) 35(PA1) 36(PA2) 48(PB2) 75(PB14) 76(PB15) 80(PD11) 81(PD12) 82(PD13) 88(PG3) 91(PG6) 92(PG7) 103(PA11) 104(PA12) 110(PA15) 118(PD4) 119(PD5) 122(PD6) 123(PD7) 127(PG12) 128(PG13) 129(PG14) 139(PB8) 140(PB9)

### Buses and harness runs
bus DCMI_D[0..7] = port DCMI_D[0..7]
bus SDRAM_A[0..12] = port SDRAM_A[0..12]
bus SDRAM_D[15..0] = port SDRAM_D[15..0]
bus USB_D[0..7] = port USB_D[7..0]

### Layout directives
net class OSC_NET: SDRAM_A6, SDRAM_A7, SDRAM_A8, SDRAM_A9, USB_D0

### Notes on the sheet
- SDRAM Address Bus
- SDRAM Data Bus
- OV5640 Data Bus
- USB_ULPI Data Bus
- Title:
- Enigneer:
- Page Contents:
- Company:
- Size:
- Date:
- File:
- Website:
- A3
- Number:
- Time:
- Revision:
- Sheet

### Library data of the parts
C1-C20 C55 C56 = 0603 Cap
FB1 = FB_0603: Ferrite Bead SMD 0603; Manufacturer: *; Manufacturer Part Number: *; Distributor Link: *; LCSC: *
J1 = PRT-14417: as J7 on sheet Microphone-Other Parts; SnapEDA_Link: https://www.snapeda.com/parts/PRT-14417/SparkFun+Electronics/view-part/?ref=snap; Package: None; Value: *; MP: PRT-14417; Check_prices: https://www.snapeda.com/parts/PRT-14417/SparkFun+Electronics/view-part/?ref=eda
R1-R5 = 0603 Res
S1 = KMR211NGLFS: Tactile Switch SPST-NO Top Actuated Surface Mount; MF: C&K Components; MP: KMR211NGLFS; Value: *; Availability: Good; Package: None; Price: None; SnapEDA_Link: https://www.snapeda.com/parts/KMR211NGLFS/C&K%20Components/view-part/561579/?ref=snap; Check_prices: https://www.snapeda.com/parts/KMR211NGLFS/C&K%20Components/view-part/561579/?ref=eda; Purchase-URL: https://pricing.snapeda.com/search/part/KMR211NGLFS/?ref=eda
U1 = CMP-12105-000003-1: IC MCU 32BIT 2MB FLASH 144LQFP; Manufacturer: STMicroelectronics; Number Of I2C Channels: 4; Number Of A/D Converters: 2; Standoff Height: 0.05mm; Interface: I2C,SPI,UART,USART,EBI/EMI,CAN,USB,LIN,IrDA,Other; Max Supply Voltage: 3.6V; Number Of Adc Channels: 36; Ram Size: 1MBytes; Number Of Cores: 1; Frequency: 400MHz; Data Bus Width: 32bits; Core Architecture: ARM Cortex-M7; Memory Size: 2MBytes; Number Of Timers/Counters: 22; Min Supply Voltage: 1.62V; Number Of Spi Channels: 6; Max Junction Temp: +125°C; Number Of I/Os: 114; Digikey Description: IC MCU 32BIT 2MB FLASH 144LQFP; Device Class L2: Embedded Processors and Controllers; Number Of Usb Channels: 2; ComponentLink2Description: Datasheet; Ipc Land Pattern Name: QFP50P2200X2200X160-144; Category: IC; Lead Free: Yes; Temperature Range High: +85°C; Mouser Description: MCU 32-Bit STM32 ARM Cortex M7 RISC 2MB Flash 1.8V/2.5V/3.3V 144-Pin LQFP Tray; RoHS: TRUE; Ambient Temperature Range Low: -40°C; Temperature Range Low: -40°C; ComponentLink2URL: https://www.st.com/resource/en/datasheet/stm32h743zi.pdf; Ambient Temperature Range High: +85°C; Octopart: https://octopart.com/stm32h743zit6-stmicroelectronics-76372529; Number Of Pwm Channels: 2; Height: 1.6mm; Manufacturer Part Number: STM32H743ZIT6; Device Class L3: Microcontrollers; Device Class L1: Integrated Circuits (ICs); Automotive: No; Memory Type: FLASH; Number Of Uart Channels: 4; Package: LQFP144-1A; Temperature: -40°C to +85°C
Y1 = CMP-27762-007794-1: Crystal 25MHz ±30ppm 18pF SMD-4 5mm x 3.2mm; ESR (Equivalent Series Resistance): 50R; Frequency Tolerance: 30ppm; Case/Package: SMD/SMT; Packaging: Tape and Reel; Height: 0.051inch; Mount: Surface Mount; Termination: SMD/SMT; Max Operating Temperature: 85°C; RoHS Compliant: Yes; Tolerance: 30ppm; Number of Pins: 4; Lead Free: Lead Free; Package Quantity: 1000; Frequency Stability: 30ppm; Operating Frequency: 25 MHz; Depth: 3.2mm; Load Capacitance: 18pF; Resistor Type: Ceramic; Frequency: 25MHz; Width: 0.126inch; Series: ABM3C; Length: 5mm; Min Operating Temperature: -40°C; Radiation Hardening: No

## Sheet Power Input.SchDoc
size A4; SheetNumber: 5; SheetTotal: 5; SPICEModelCacheNFRRDGBC: <root> / <DocumentId>NFRRDGBC</DocumentId> / </root>
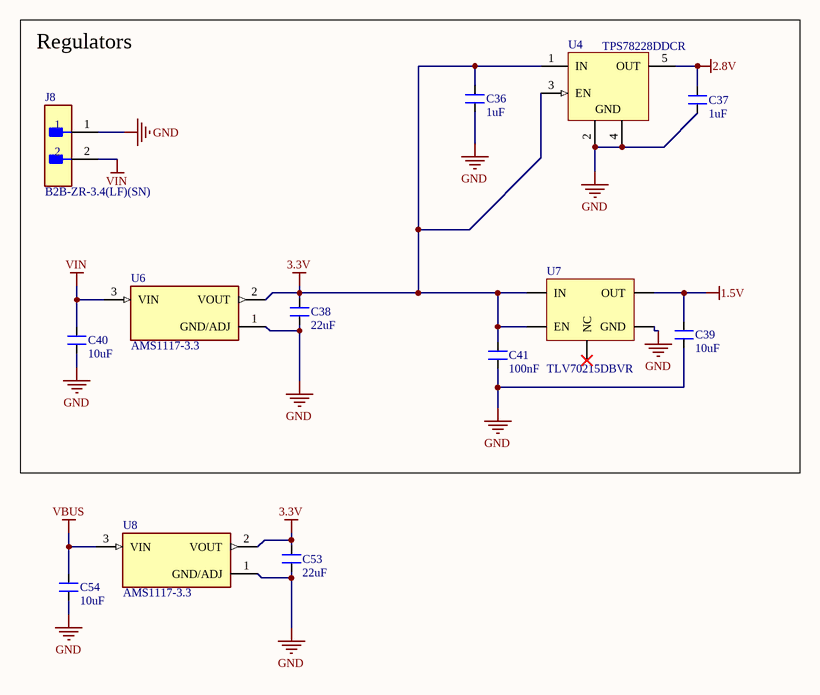
[diagram p4: Power Input.SchDoc]

### Parts
C36  1uF  [CAP_0805]
C37  1uF  [CAP_0805]
C38  22uF  [CAP_0805]
C39  10uF  [CAP_0805]
C40  10uF  [CAP_0805]
C41  100nF  [CAP_0805]
C53  22uF  [CAP_0805]
C54  10uF  [CAP_0805]
J8  B2B-ZR-3.4(LF)(SN)  [FP-B2B-ZR-3_4_LF_SN-MFG]
U4  TPS78228DDCR  [DDC0005A_L]
U6  AMS1117-3.3  [SOT229P700X180-4N]
U7  TLV70215DBVR  [TLV70215DBVR]
U8  AMS1117-3.3  [SOT229P700X180-4N]

### Blocks framed on the sheet
Regulators: C36-C41 J8 U4 U6 U7

### Nets
1.5V: C39.2 U7.5(OUT)
2.8V: C37.2 U4.5(OUT)
3.3V: C36.2 C38.2 C41.2 C53.2 U4.1(IN) U4.3(EN) U6.2(VOUT) U7.1(IN) U7.3(EN) U8.2(VOUT)
GND: C36.1 C37.1 C38.1 C39.1 C40.1 C41.1 C53.1 C54.1 J8.1 U4.2(GND) U4.4(GND) U6.1(GND/ADJ) U7.2(GND) U8.1(GND/ADJ)
VBUS: C54.2 U8.3(VIN)
VIN: C40.2 J8.2 U6.3(VIN)

Not connected (* = marked no-connect by the designer): U7 4(NC)*

### Notes on the sheet
- Title:
- Enigneer:
- Page Contents:
- Company:
- Size:
- Date:
- File:
- Website:
- A4
- Number:
- Time:
- Revision:
- Sheet

### Library data of the parts
C36 C37 C39-C41 C54 = CAP_10nF-50V-10%-0805: 10000pF ±10% 50V Ceramic Capacitor X7R 0805 (2012 Metric); Manufacturer: Samsung; Manufacturer Part Number: C0805C103K5RECAUTO; Alternate Part Number-1: GRM2195C1H103JA01D; Case/Package: 0805; Supplier-1: SIRICOM; Supplier Part Number-1: 0805B103K500CT
C38 C53 = CAP_22uF-25V-20%-0805: 22µF ±20% 25V Ceramic Capacitor X5R 0805 (2012 Metric); Manufacturer: Murata; Manufacturer Part Number: GRM21BR61E226ME44L; Alternate Part Number-1: NA; Case/Package: 0805; Supplier-1: LCSC; Supplier Part Number-1: C86816
J8 = CMP-17439-000601-1: CONN HEADER VERT 2POS 1.5MM; Mated Stacking Heights: 5.6mm; Voltage Rating: 50V; Number of Positions: 2; Termination: Press-Fit; Insulation Color: Natural; Pitch: 1.5mm; Number of Rows: 1; Fastening Type: Detent; Insulation Material: Nylon; Contact Shape: Circular; Lead Free: Lead Free; Series: ZH; Connector Type: Header; Contact Type: Male Pin; Packaging: Bulk; Contact Finish - Mating: TIN; Mount: Through Hole; Contact Material: Brass; Flammability Rating: UL94 V-0
U4 = CMP-0394-01012-2: Single Output LDO, 150 mA, Fixed 2.8 V Output, 2.2 to 5.5 V Input, with 0.5 uA Quiescent Current, 5-pin SOT (DDC), -40 to 85 degC, Green (RoHS & no Sb/Br); Manufacturer: Texas Instruments; Vout Adj(Min)(V): 2.8; SubFamily: Single Channel LDO; Iout(Max)(A): 0.15; Vin(Max)(V): 5.5; Rating: Catalog; Vin(Min)(V): 2.2; Iq(Typ)(mA): 0.0005; Accuracy(%): 3; Vdo(Typ)(mV): 130; Fixed Output Options(V): 2.8; Mounting Technology: Surface Mount; ComponentLink2URL: http://www.ti.com/general/docs/lit/getliterature.tsp?genericPartNumber=TPS78228&fileType=pdf; ComponentLink3Description: Package Specification; Code_JEDEC: MO-193; ComponentLink2Description: Datasheet; PackageReference: DDC0005A; ComponentLink3URL: http://www.ti.com/litv/pdf/mpds123d; ComponentLink1URL: http://www.ti.com/; DatasheetVersion: SBVS115B; ComponentLink1Description: Manufacturer URL; PackageDescription: 5-Pin Plastic Small Outline, Body 2.9 x 1.6 mm, 0.95 mm Pitch; Vout Adj(Max)(V): 2.8; Eco-Plan: Green (RoHS & no Sb/Br); PackageVersion: 4204403-2/E; PartNumber: TPS78228DDCR
U6 U8 = AMS1117-3.3: Sot223/Pkg 1-Amp 3.3-Volt Low Drop Out Voltage Regulatator; MF: Advanced Monolithic Systems; Package: SOT-223 Seeed Technology; Value: *; Check_prices: https://www.snapeda.com/parts/AMS1117-3.3/Advanced+Monolithic+Systems/view-part/?ref=eda; Price: None; Availability: Not in stock; MP: AMS1117-3.3; SnapEDA_Link: https://www.snapeda.com/parts/AMS1117-3.3/Advanced+Monolithic+Systems/view-part/?ref=snap

## Nets that join several sheets
1.5V: OV5640 Camera (J2.10 R6.2), Power Input (C39.2 U7.5)
2.8V: OV5640 Camera (C22.1 J2.04 J2.11), Power Input (C37.2 U4.5)
3.3V: External SDRAM (16 pins), Microphone-Other Parts (17 pins), STM32H743 MCU (34 pins), Power Input (10 pins)
GND: OV5640 Camera (6 pins), External SDRAM (16 pins), Microphone-Other Parts (37 pins), STM32H743 MCU (38 pins), Power Input (14 pins)
VBUS: Microphone-Other Parts (5 pins), Power Input (C54.2 U8.3)
DCMI_D0: OV5640 Camera (J2.19), STM32H743 MCU (U1.96)
DCMI_D1: OV5640 Camera (J2.21), STM32H743 MCU (U1.97)
DCMI_D2: OV5640 Camera (J2.22), STM32H743 MCU (U1.125)
DCMI_D3: OV5640 Camera (J2.20), STM32H743 MCU (U1.126)
DCMI_D4: OV5640 Camera (J2.18), STM32H743 MCU (U1.3)
DCMI_D5: OV5640 Camera (J2.16), STM32H743 MCU (U1.117)
DCMI_D6: OV5640 Camera (J2.14), STM32H743 MCU (U1.4)
DCMI_D7: OV5640 Camera (J2.12), STM32H743 MCU (U1.5)
NetJ2_03: OV5640 Camera (J2.03), STM32H743 MCU (U1.137)
NetJ2_05: OV5640 Camera (J2.05), STM32H743 MCU (U1.136)
NetJ2_06: OV5640 Camera (J2.06), STM32H743 MCU (U1.18)
NetJ2_07: OV5640 Camera (J2.07), STM32H743 MCU (U1.124)
NetJ2_09: OV5640 Camera (J2.09), STM32H743 MCU (U1.40)
NetJ2_13: OV5640 Camera (J2.13), STM32H743 MCU (U1.100)
NetJ2_17: OV5640 Camera (J2.17), STM32H743 MCU (U1.42)
NetJ7_2: Microphone-Other Parts (J7.2), STM32H743 MCU (U1.101)
NetJ7_3: Microphone-Other Parts (J7.3), STM32H743 MCU (U1.102)
NetR8_1: Microphone-Other Parts (R8.1), STM32H743 MCU (U1.99)
NetR9_1: Microphone-Other Parts (R9.1), STM32H743 MCU (U1.98)
NetR10_1: Microphone-Other Parts (R10.1), STM32H743 MCU (U1.113)
NetR11_1: Microphone-Other Parts (R11.1), STM32H743 MCU (U1.116)
NetR13_1: Microphone-Other Parts (R13.1), STM32H743 MCU (U1.112)
NetR14_1: Microphone-Other Parts (R14.1), STM32H743 MCU (U1.111)
NetU1_26: Microphone-Other Parts (U5.13), STM32H743 MCU (U1.26)
NetU1_28: Microphone-Other Parts (U5.12), STM32H743 MCU (U1.28)
NetU1_29: Microphone-Other Parts (U5.11), STM32H743 MCU (U1.29)
NetU1_41: Microphone-Other Parts (U5.14), STM32H743 MCU (U1.41)
NetU1_43: External SDRAM (U2.16), STM32H743 MCU (U1.43)
NetU1_44: External SDRAM (U2.19), STM32H743 MCU (U1.44)
NetU1_45: External SDRAM (U2.37), STM32H743 MCU (U1.45)
NetU1_49: External SDRAM (U2.18), STM32H743 MCU (U1.49)
NetU1_89: External SDRAM (U2.20), STM32H743 MCU (U1.89)
NetU1_90: External SDRAM (U2.21), STM32H743 MCU (U1.90)
NetU1_93: External SDRAM (U2.38), STM32H743 MCU (U1.93)
NetU1_132: External SDRAM (U2.17), STM32H743 MCU (U1.132)
NetU1_133: Microphone-Other Parts (U3.3), STM32H743 MCU (U1.133)
NetU1_134: Microphone-Other Parts (U3.4), STM32H743 MCU (U1.134)
NetU1_141: External SDRAM (U2.15), STM32H743 MCU (U1.141)
NetU1_142: External SDRAM (U2.39), STM32H743 MCU (U1.142)
SDRAM_A0: External SDRAM (U2.23), STM32H743 MCU (U1.10)
SDRAM_A1: External SDRAM (U2.24), STM32H743 MCU (U1.11)
SDRAM_A2: External SDRAM (U2.25), STM32H743 MCU (U1.12)
SDRAM_A3: External SDRAM (U2.26), STM32H743 MCU (U1.13)
SDRAM_A4: External SDRAM (U2.29), STM32H743 MCU (U1.14)
SDRAM_A5: External SDRAM (U2.30), STM32H743 MCU (U1.15)
SDRAM_A6: External SDRAM (U2.31), STM32H743 MCU (U1.50)
SDRAM_A7: External SDRAM (U2.32), STM32H743 MCU (U1.53)
SDRAM_A8: External SDRAM (U2.33), STM32H743 MCU (U1.54)
SDRAM_A9: External SDRAM (U2.34), STM32H743 MCU (U1.55)
SDRAM_A10: External SDRAM (U2.22), STM32H743 MCU (U1.56)
SDRAM_A11: External SDRAM (U2.35), STM32H743 MCU (U1.57)
SDRAM_A12: External SDRAM (U2.36), STM32H743 MCU (U1.87)
SDRAM_D0: External SDRAM (U2.2), STM32H743 MCU (U1.85)
SDRAM_D1: External SDRAM (U2.4), STM32H743 MCU (U1.86)
SDRAM_D2: External SDRAM (U2.5), STM32H743 MCU (U1.114)
SDRAM_D3: External SDRAM (U2.7), STM32H743 MCU (U1.115)
SDRAM_D4: External SDRAM (U2.8), STM32H743 MCU (U1.58)
SDRAM_D5: External SDRAM (U2.10), STM32H743 MCU (U1.59)
SDRAM_D6: External SDRAM (U2.11), STM32H743 MCU (U1.60)
SDRAM_D7: External SDRAM (U2.13), STM32H743 MCU (U1.63)
SDRAM_D8: External SDRAM (U2.42), STM32H743 MCU (U1.64)
SDRAM_D9: External SDRAM (U2.44), STM32H743 MCU (U1.65)
SDRAM_D10: External SDRAM (U2.45), STM32H743 MCU (U1.66)
SDRAM_D11: External SDRAM (U2.47), STM32H743 MCU (U1.67)
SDRAM_D12: External SDRAM (U2.48), STM32H743 MCU (U1.68)
SDRAM_D13: External SDRAM (U2.50), STM32H743 MCU (U1.77)
SDRAM_D14: External SDRAM (U2.51), STM32H743 MCU (U1.78)
SDRAM_D15: External SDRAM (U2.53), STM32H743 MCU (U1.79)
USB_D0: Microphone-Other Parts (U5.24), STM32H743 MCU (U1.37)
USB_D1: Microphone-Other Parts (U5.23), STM32H743 MCU (U1.46)
USB_D2: Microphone-Other Parts (U5.22), STM32H743 MCU (U1.47)
USB_D3: Microphone-Other Parts (U5.21), STM32H743 MCU (U1.69)
USB_D4: Microphone-Other Parts (U5.20), STM32H743 MCU (U1.70)
USB_D5: Microphone-Other Parts (U5.19), STM32H743 MCU (U1.73)
USB_D6: Microphone-Other Parts (U5.18), STM32H743 MCU (U1.74)
USB_D7: Microphone-Other Parts (U5.17), STM32H743 MCU (U1.135)